# Altium schematic sheet Power.SchDoc
size A4; SheetNumber: 2; SheetTotal: 10
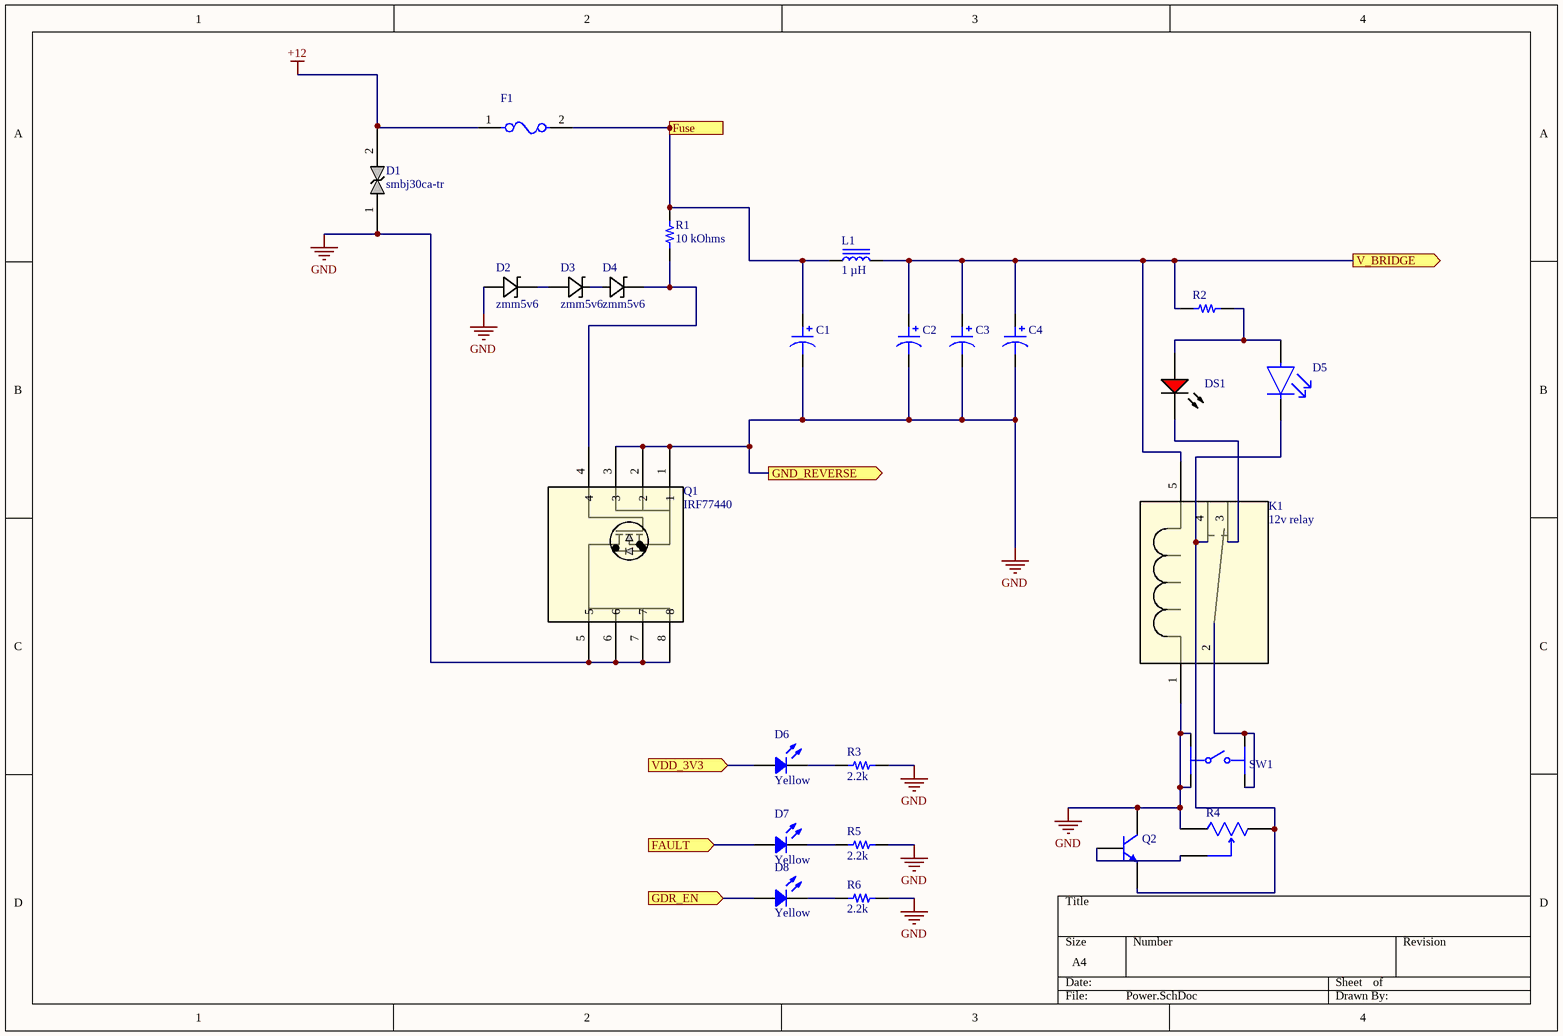
[diagram p0: Power.SchDoc]

## Parts
C1  100 µF  [CAP POL 1411_3528]  (value not drawn)
C2  100 µF  [CAP POL 1411_3528]  (value not drawn)
C3  100 µF  [CAP POL 1411_3528]  (value not drawn)
C4  100 µF  [CAP POL 1411_3528]  (value not drawn)
D1  smbj30ca-tr  [smbj30ca-tr]
D2  zmm5v6  [zmm5v6]
D3  zmm5v6  [zmm5v6]
D4  zmm5v6  [zmm5v6]
D5  LTST-C190GKT  [FP-LTST-C190GKT-MFG]  (value not drawn)
D6  Yellow  [LED 0402_1005 YELLOW]
D7  Yellow  [LED 0402_1005 YELLOW]
D8  Yellow  [LED 0402_1005 YELLOW]
DS1  TLMS1100-GS08  [VISH-TLMX1100_V]  (value not drawn)
F1  SF-2923UC60C-2  [FP-SF-2923-MFG]  (value not drawn)
K1  12v relay  [12V relay]
L1  1 µH  [WURTH WE-HCI 7040]
Q1  IRF77440  [IRF77440]
Q2  BC547B  [ONSC-TO-92-3-29-11]  (value not drawn)
R1  10 kOhms  [RES 0603_1608]
R2  1 kOhms  [RES 1206_3216]  (value not drawn)
R3  2.2k  [RES 0603_1608]
R4  TS53YJ104MR10  [FP-TS53YJ-MFG]  (value not drawn)
R5  2.2k  [RES 0603_1608]
R6  2.2k  [RES 0603_1608]
SW1  3-1825910-1  [FP-3-1825910-1-MFG]  (value not drawn)

## Ports
FAULT (in, see MCU[3C]), Fuse (out, see DC_Current_Voltage_Measurement[2B]), GDR_EN (in, see MCU[3B], MotorDrivers[1B]), GND_REVERSE (out, see DC_Current_Voltage_Measurement[2A]), V_BRIDGE (out, see DC-DC_Buck_Converter+12Vto+3.3V[1A], DC_Current_Voltage_Measurement[3B], MotorDrivers[3C], Motors[1A]), VDD_3V3 (in, see ADC_Input_protection[3C], DC-DC_Buck_Converter+12Vto+3.3V[3C], DC_Current_Voltage_Measurement[3B], MCU[1B], MotorDrivers[1A], MotorDrivers[1B], ZeroCrossing[1A])

## Nets
+12: D1.2 F1.1
GND: C1.2 C2.2 C3.2 C4.2 D1.1 D2.2(ANODE) K1.1 Q1.1 Q1.2 Q1.3 Q1.5 Q1.6 Q1.7 Q1.8 Q2.1(C) R3.1 R4.1(a) R5.1 R6.1 SW1.1 SW1.2 ; port GND_REVERSE
FAULT: D7.1 ; port FAULT
Fuse: C1.1 F1.2 L1.1 R1.2 ; port Fuse
GDR_EN: D8.1 ; port GDR_EN
V_BRIDGE: C2.1 C3.1 C4.1 K1.5 L1.2 R2.2 ; port V_BRIDGE
VDD_3V3: D6.1 ; port VDD_3V3
NetD2_1: D2.1(CATHODE) D3.2(ANODE)
NetD3_1: D3.1(CATHODE) D4.2(ANODE)
NetD4_1: D4.1(CATHODE) Q1.4 R1.1
NetD5_1: D5.1(C) K1.4 Q2.3(E) R4.3(c)
NetD5_2: D5.2(A) DS1.1(A) R2.1
NetD6_2: D6.2 R3.2
NetD7_2: D7.2 R5.2
NetD8_2: D8.2 R6.2
NetDS1_2: DS1.2(K) K1.3
NetK1_2: K1.2 SW1.3 SW1.4
NetQ2_2: Q2.2(B) R4.2(b)

## Library data of the parts
C1-C4 = T495B107M006ATE700: CAP TANT 100UF 20% 6.3V 1411; manufacturer: KEMET; Manufacturer Size Code: B; ESR (Equivalent Series Resistance): 700mOhm; Lifetime @ Temp.: 2000 Hrs @ 85°C; Type: Molded; Part Number: T495B107M006ATE700; Value: 100 µF; Capacitance: 100 µF; componentlink1description: Datasheet; componentlink1url: https://api.kemet.com/component-edge/download/datasheet/T495B107M006ATE700.pdf; componentlink2description: DigiKey Link; componentlink2url: https://www.digikey.com/en/products/detail/kemet/T495B107M006ATE700/818735; Device Package: 1411 (3528 Metric); Features: General Purpose; Height - Seated (Max): 0.083" (2.10mm); lastupdated: 3.10.2023 19:55:50; Lifecycle Status: Active; Minimum Order: 1; Mounting Type: Surface Mount; Operating Temperature: -55°C ~ 125°C; Package / Case: 1411 (3528 Metric); packaging: TapeAndReel; partid: 29; Part Status: Active; price: 0.54; series: T495; Size / Dimension: 0.138" L x 0.110" W (3.50mm x 2.80mm); Supplier 1: DigiKey; Supplier Part Number 1: 399-3875-1-ND; Tolerance: ±20%; Voltage - Rated: 6.3 V
D5 = CMP-22017-000005-2: LED GREEN CLEAR CHIP SMD; Dominant Wavelength: 569nm; Reverse Voltage: 5V; Lens Color: Colorless; Viewing Angle: 130°; Voltage: 2V; Forward Current: 30mA; Power Dissipation: 100mW; Luminous Intensity: 6mcd; Number of LEDs: 1; Forward Voltage: 2.1V; Wavelength: 565nm; Test Current: 10mA; Min Operating Temperature: -55°C; Lens Style: Clear; Mount: Surface Mount; Width: 0.8mm; Packaging: Tape and Reel; Lens Transparency: Clear; Case Code (Metric): 1608; Depth: 0.8mm; Case Code (Imperial): 0603; Case/Package: 0603; Number of Pins: 2; Max Operating Temperature: 85°C; Lead Free: Lead Free; Number of Elements: 1; Length: 1.6mm; Height: 0.8mm; Package Quantity: 1; Power Rating: 100mW; Radiation Hardening: No; Illumination Color: Green; Color: Green
D6-D8 = 5988A40107F: SM LED 0402 YEL 590NM; Manufacturer: Dialight; Configuration: 0402; Current - Test: 5mA; Lens Color: 0.60mm; Lens Size: 1.00mm x 0.50mm; Lens Style: Rectangle with Flat Top; Millicandela Rating: 42mcd; Voltage - Forward (Vf) (Typ): 1.8V; Wavelength - Dominant: 591nm; Part Number: 5988A40107F; Color: Yellow; ComponentLink1Description: Datasheet; ComponentLink1URL: http://www.dialightsignalsandcomponents.com/Assets/Drawings/2D_Drawings_DrawingDetailedSpec/NewDrawings/C18402A.pdf; ComponentLink2Description: DigiKey Link; ComponentLink2URL: https://www.digikey.com/en/products/detail/dialight/5988A40107F/10108965; Device Package: 0402 (1005 Metric); Height (Max): 0.60mm; LastUpdated: 8.10.2023 20:19:46; Lifecycle Status: Active; Minimum Order: 1; Mounting Type: Surface Mount; Package / Case: 0402 (1005 Metric); Packaging: TapeAndReel; PartId: 164; Part Status: Active; Price: 0.06; Series: 598; Size / Dimension: 1.00mm L x 0.50mm W; Supplier 1: DigiKey; Supplier Part Number 1: 350-4449-1-ND; Supplier Device Package: 0402; Value: Yellow
DS1 = CMP-1666-00027-1: LED, RED, 2.1 V, -40 to 100 degC, 2-Pin SMD (0603), RoHS, Tape and Reel; Type (Capacitors): C0G; Resistance: 100000000000 Ohm; Capacitance: 12 pF; Voltage Rating: 50 V; Tolerance: 5%; Min Operating Temperature: -55degC; REACH SVHC: No SVHC; ComponentLink2Description: Datasheet; ComponentLink1URL: http://www.vishay.com/; Width: 0.8 mm; Package Quantity: 4000; PackageReference: TLMX1100; ComponentLink2URL: http://www.vishay.com/docs/83173/tlmb1100.pdf; Case/Package: 0603; Case Code (Metric): 1608; Packaging: Tape and Reel; Pins: 2; ComponentLink1Description: Manufacturer URL; Max Operating Temperature: 125degC; Height: 0.8 mm; Length: 1.6 mm; Mount: Surface Mount; PackageDescription: 2-Pin Surface Mount Device, Body 1.6 x 0.8 mm; DatasheetVersion: Rev. 2.7, 03/2016; Case Code (Imperial): 0603; Voltage Rating (DC): 50 V; RoHSCompliant: True; Radiation Hardening: No
F1 = CMP-07399-000001-1: SINGLFUSE 2923 ULTRA-HIGH-I 80VD; Manufacturer: Bourns; Fuse Current: 60A; Value: 0.00065Ω; Max Fuse Dc Voltage: 80V; Fuse Blow Speed: Fast; Fuse Interrupt Dc Current: 450A; Fuse I2T: 1260A2Sec; Temperature: -55°C to +125°C; Category: Fuse; Lead Free: Yes; RoHS: TRUE; Device Class L1: Circuit Protection; Temperature Range Low: -55°C; Manufacturer Part Number: SF-2923UC60C-2; Automotive: No; Octopart: https://octopart.com/sf-2923uc60c-2-bourns-98542147; Height: 4.2mm; Package: SF-2923; ComponentLink2URL: http://www.bourns.com/docs/Product-Datasheets/SF-2923uc.pdf; Device Class L2: Fuses; Voltage Rating: 80V; Device Class L3: unset; ComponentLink2Description: Datasheet; Digikey Description: SINGLFUSE 2923 ULTRA-HIGH-I 80VD; Resistance: 0.00065Ω; Temperature Range High: +125°C
L1 = 744311100: FIXED IND 1UH 15A 4.6 MOHM SMD; Manufacturer: Würth Elektronik; Current - Saturation: 19A; Frequency - Self Resonant: 85MHz; Inductance Frequency - Test: 100 kHz; Material - Core: Nonstandard; Shielding: Shielded; Tolerance: ±20%; Type: Wirewound; Part Number: 744311100; ComponentLink1Description: Datasheet; ComponentLink1URL: https://katalog.we-online.de/pbs/datasheet/744311100.pdf; ComponentLink2Description: DigiKey Link; ComponentLink2URL: https://www.digikey.com/en/products/detail/würth-elektronik/744311100/3476747; Current Rating (Amps): 15 A; DC Resistance (DCR): 4.6mOhm; Device Package: Nonstandard; Height - Seated (Max): 0.157" (4.00mm); Inductance: 1 µH; LastUpdated: 3.10.2023 20:25:36; Lifecycle Status: Active; Minimum Order: 1; Mounting Type: Surface Mount; Operating Temperature: -40°C ~ 150°C; Package / Case: Nonstandard; Packaging: TapeAndReel; PartId: 260; Part Status: Active; Price: 2.72; Ratings: AEC-Q200; Series: WE-HCI; Size / Dimension: 0.276" L x 0.272" W (7.00mm x 6.90mm); Supplier 1: DigiKey; Supplier Part Number 1: 732-4177-1-ND; Supplier Device Package: 7040; Value: 1 µH
Q2 = CMP-1048-01467-1: Amplifier Transistor, NPN Silicon, 3-Pin TO-92, Bulk Box; Manufacturer: On Semiconductor; IC Continuous (A): 0.1; fT Min (MHz): 150; DatasheetVersion: Rev. 7; ComponentLink1URL: http://www.onsemi.com/; Polarity: NPN; RoHS: FALSE; ComponentLink1Description: Manufacturer URL; Packing: Bulk Box; PackageDescription: 3-Pin Transistor Outline, Body 4.825 x 3.685 mm, Pitch 1.27 mm; ComponentLink3URL: http://www.onsemi.cn/pub_link/Collateral/2N6426-D.PDF; ComponentLink2Description: Datasheet; PackageVersion: Rev. AM; PackageReference: TO-92-3-29-11_AM_SL; ComponentLink3Description: Package Specification; Mounting Technology: Through Hole; PartNumber: BC547B; ComponentLink2URL: http://www.onsemi.com/pub_link/Collateral/BC546-D.PDF
R1 = RM06F1002CT: RES0603 1% 10K OHM; Manufacturer: Cal-Chip Electronics, Inc.; Power (Watts): 0.1W, 1/10W; Temperature Coefficient: ±100ppm/°C; Part Number: RM06F1002CT; Value: 10 kOhms; ComponentLink2Description: DigiKey Link; ComponentLink2URL: https://www.digikey.com/en/products/detail/cal-chip-electronics-inc/RM06F1002CT/18151076; Composition: Thick Film; Device Package: 0603 (1608 Metric); Height - Seated (Max): 0.022" (0.55mm); LastUpdated: 3.10.2023 19:33:57; Lifecycle Status: Active; Minimum Order: 1; Number of Terminations: 2; Operating Temperature: -55°C ~ 155°C; Package / Case: 0603 (1608 Metric); Packaging: CutTape; PartId: 76557; Part Status: Active; Price: 0.01; Resistance: 10 kOhms; Series: RM; Size / Dimension: 0.063" L x 0.031" W (1.60mm x 0.80mm); Supplier 1: DigiKey; Supplier Part Number 1: 4713-RM06F1002CT-ND; Supplier Device Package: 0603; Tolerance: ±1%
R2 = RNCP1206FTD1K00: RES 1K OHM 1% 1/2W 1206; Manufacturer: Stackpole Electronics Inc; Power (Watts): 0.5W, 1/2W; Temperature Coefficient: ±100ppm/°C; Part Number: RNCP1206FTD1K00; ComponentLink1Description: Datasheet; ComponentLink1URL: https://www.seielect.com/catalog/sei-rncp.pdf; ComponentLink2Description: DigiKey Link; ComponentLink2URL: https://www.digikey.com/en/products/detail/stackpole-electronics-inc/RNCP1206FTD1K00/2240337; Composition: Thin Film; Device Package: 1206 (3216 Metric); Features: Anti-Sulfur; Height - Seated (Max): 0.025" (0.65mm); LastUpdated: 12.10.2023 19:48:17; Lifecycle Status: Active; Minimum Order: 1; Number of Terminations: 2; Operating Temperature: -55°C ~ 155°C; Package / Case: 1206 (3216 Metric); Packaging: TapeAndReel; PartId: 26970; Part Status: Active; Price: 0.01; Resistance: 1 kOhms; Series: RNCP; Size / Dimension: 0.122" L x 0.059" W (3.10mm x 1.50mm); Supplier 1: DigiKey; Supplier Part Number 1: RNCP1206FTD1K00CT-ND; Supplier Device Package: 1206; Tolerance: ±1%; Value: 1 kOhms
R3 R5 R6 = RM06F1002CT: RES0603 1% 10K OHM; Manufacturer: Cal-Chip Electronics, Inc.; Power (Watts): 0.1W, 1/10W; Resistance: 2.2kOhms; Temperature Coefficient: ±100ppm/°C; Part Number: RM06F1002CT; Value: 2.2k; ComponentLink2Description: DigiKey Link; ComponentLink2URL: https://www.digikey.com/en/products/detail/cal-chip-electronics-inc/RM06F1002CT/18151076; Composition: Thick Film; Device Package: 0603 (1608 Metric); Height - Seated (Max): 0.022" (0.55mm); LastUpdated: 3.10.2023 19:33:57; Lifecycle Status: Active; Minimum Order: 1; Number of Terminations: 2; Operating Temperature: -55°C ~ 155°C; Package / Case: 0603 (1608 Metric); Packaging: CutTape; PartId: 76557; Part Status: Active; Price: 0.01; Series: RM; Size / Dimension: 0.063" L x 0.031" W (1.60mm x 0.80mm); Supplier 1: DigiKey; Supplier Part Number 1: 4713-RM06F1002CT-ND; Supplier Device Package: 0603; Tolerance: ±1%
R4 = CMP-02410-000010-1: TRIMMER 100KOHM 0.25W J LEAD TOP; Power Rating: 250mW; Resistance: 100kR; Tolerance: 20%; Temperature Coefficient: 100ppm/°C; Number of Turns: 1; Package Quantity: 1; Max Operating Temperature: 125°C; Technology: CERMET; Packaging: Tape and Reel; Taper: Linear; Length: 0.197inch; Max Power Dissipation: 250mW; Military Standard: Not; Depth: 5.5mm; Series: TS53Y; RoHS Compliant: Yes; Lead Free: Lead Free; Min Operating Temperature: -55°C; Mount: Surface Mount; Resistance Tolerance: 20%; Resistor Type: Cermet; Height: 0.106inch; Width: 0.197inch; Termination: SMD/SMT; Radiation Hardening: No
SW1 = CMP-03407-000001-1: SWITCH TACTILE SPST-NO 0.05A 24V; Manufacturer: TE Connectivity; Operating Force: 160gf; Contact Current Rating: 50mA; Contact Resistance: 100mΩ; Electromechanical Life: 100000Cycles; Device Class L1: Electromechanical; ComponentLink2URL: https://www.te.com/commerce/DocumentDelivery/DDEController?Action=srchrtrv&DocNm=1825910&DocType=Customer+Drawing&DocLang=English; Category: Switch; Device Class L2: Switches; Temperature: -35°C to +85°C; RoHS: TRUE; Mount: Through Hole; Manufacturer Part Number: 3-1825910-1; Automotive: No; Lead Free: Yes; Device Class L3: Tactile Switches; ComponentLink2Description: Datasheet; Temperature Range High: +85°C; Height: 17.3mm; Package: 0; Temperature Range Low: -35°C; Throw Configuration: SPST-NO; Digikey Description: SWITCH TACTILE SPST-NO 0.05A 24V; Octopart: https://octopart.com/3-1825910-1-te+connectivity-46506874